# Altium schematic sheet Main.SchDoc
size A; SheetNumber: 1; SheetTotal: 1
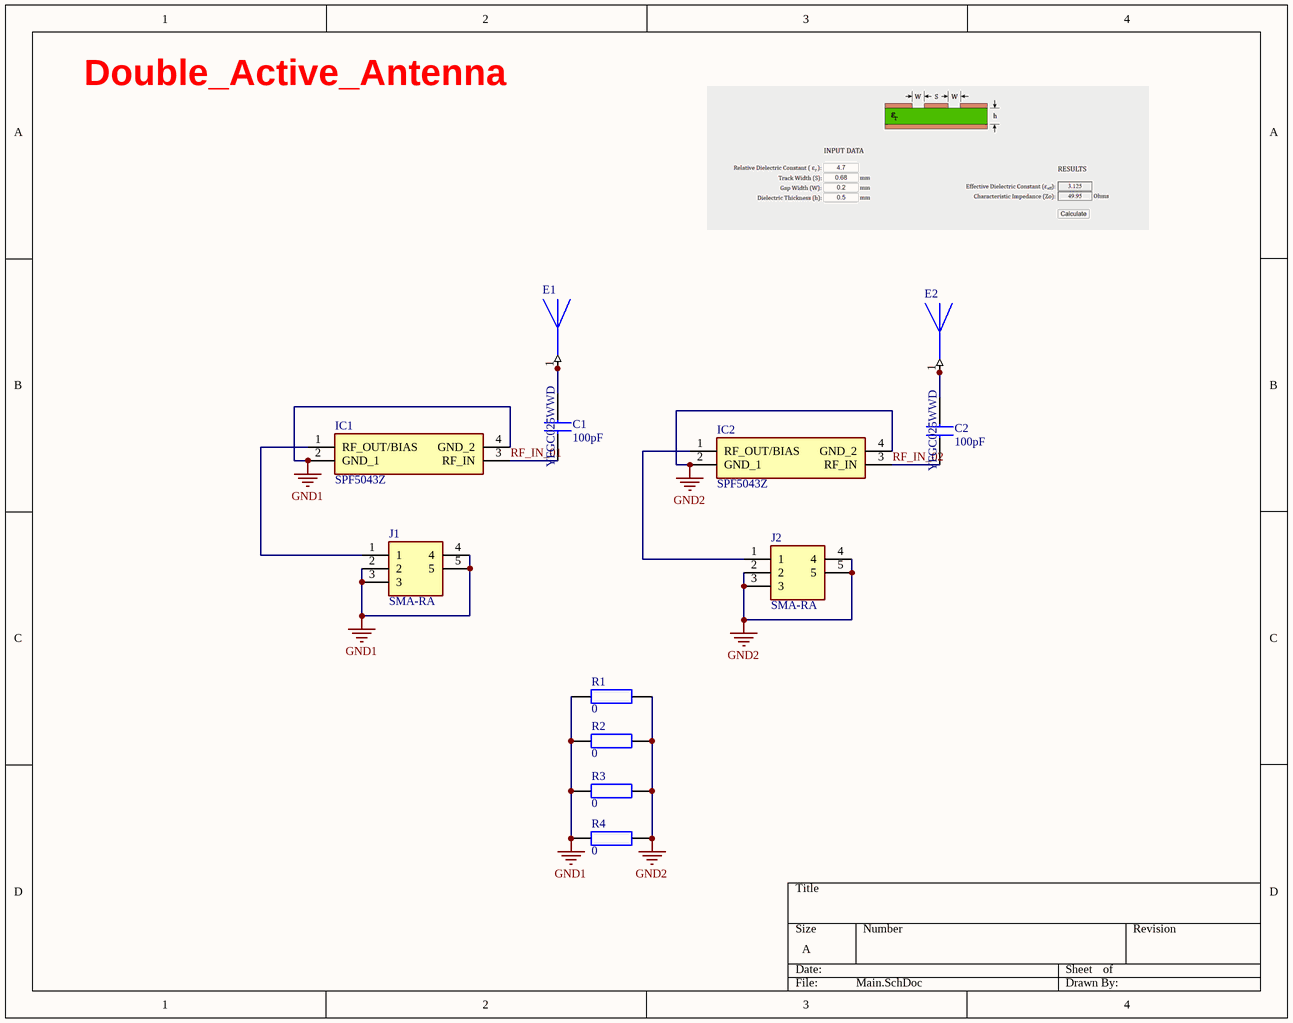
[diagram p0: Main.SchDoc]

## Parts
C1  100pF  [GRM1885C1H101JA01D]
C2  100pF  [GRM1885C1H101JA01D]
E1  YFGC025WWD  [XDCR_YFGC025WWD]
E2  YFGC025WWD  [XDCR_YFGC025WWD]
IC1  SPF5043Z  [SPF5043Z]
IC2  SPF5043Z  [SPF5043Z]
J1  SMA-RA  [132135]
J2  SMA-RA  [132135]
R1  0  [RESC0805X05N]
R2  0  [RESC0805X05N]
R3  0  [RESC0805X05N]
R4  0  [RESC0805X05N]

## Nets
GND1: IC1.2(GND_1) IC1.4(GND_2) J1.2 J1.3 J1.4 J1.5 R1.1 R2.1 R3.1 R4.1
GND2: IC2.2(GND_1) IC2.4(GND_2) J2.2 J2.3 J2.4 J2.5 R1.2 R2.2 R3.2 R4.2
RF_IN_01: C1.1 IC1.3(RF_IN)
RF_IN_02: C2.1 IC2.3(RF_IN)
NetC1_2: C1.2 E1.1(FEED)
NetC2_2: C2.2 E2.1(FEED)
NetIC1_1: IC1.1(RF_OUT/BIAS) J1.1
NetIC2_1: IC2.1(RF_OUT/BIAS) J2.1

## Notes on the sheet
- Double_Active_Antenna

## Library data of the parts
C1 C2 = GRM1885C1H101JA01D: Capacitor; Manufacturer_Name: Murata Electronics; Datasheet Link: https://search.murata.co.jp/Ceramy/image/img/A01X/G101/ENG/GRM1885C1H101JA01-01A.pdf; Height: 0.9mm; Manufacturer_Part_Number: GRM1885C1H101JA01D; Mouser Part Number: 81-GRM39C101J50; Mouser Price/Stock: https://www.mouser.co.uk/ProductDetail/Murata-Electronics/GRM1885C1H101JA01D?qs=H3lwsW1hsDt1I4guwPQ00A%3D%3D; Arrow Part Number: GRM1885C1H101JA01D; Arrow Price/Stock: https://www.arrow.com/en/products/grm1885c1h101ja01d/murata-manufacturing?region=europe
IC1 IC2 = SPF5043Z: Integrated Circuit; Manufacturer_Name: Qorvo; Datasheet Link: https://www.qorvo.com/products/d/da001897; Manufacturer_Part_Number: SPF5043Z; Mouser Part Number: 772-SPF5043Z; Mouser Price/Stock: https://www.mouser.co.uk/ProductDetail/Qorvo/SPF5043Z?qs=p6lVfQR1GSoUob90DTnCEA%3D%3D
J1 J2 = 132135: Connector; Manufacturer_Name: Amphenol; Datasheet Link: https://s3-us-west-2.amazonaws.com/catsy.582/132135.pdf; Height: 10.26mm; Manufacturer_Part_Number: 132135; Mouser Part Number: 523-132135; Mouser Price/Stock: https://www.mouser.co.uk/ProductDetail/Amphenol-RF/132135?qs=b8dDPpdgesuISdo6zUNLtg%3D%3D; Arrow Part Number: 132135; Arrow Price/Stock: https://www.arrow.com/en/products/132135/amphenol
R1-R4 = Resistor2P: The resistors have 2PIN in AXIAL and SMD models. / All wattage include in.; Version: 1.3; Create Date: 2022/07/24; Must Assemble: *; Part Number: *; Modified Date: 2025/03/01; Company: *; Value: 0
E1 E2 = YFGC025WWD: Package: None; Price: None; Value: *; MP: YFGC025WWD; Availability: Unavailable